# Altium schematic sheet top.SchDoc
size C; SheetNumber: 1
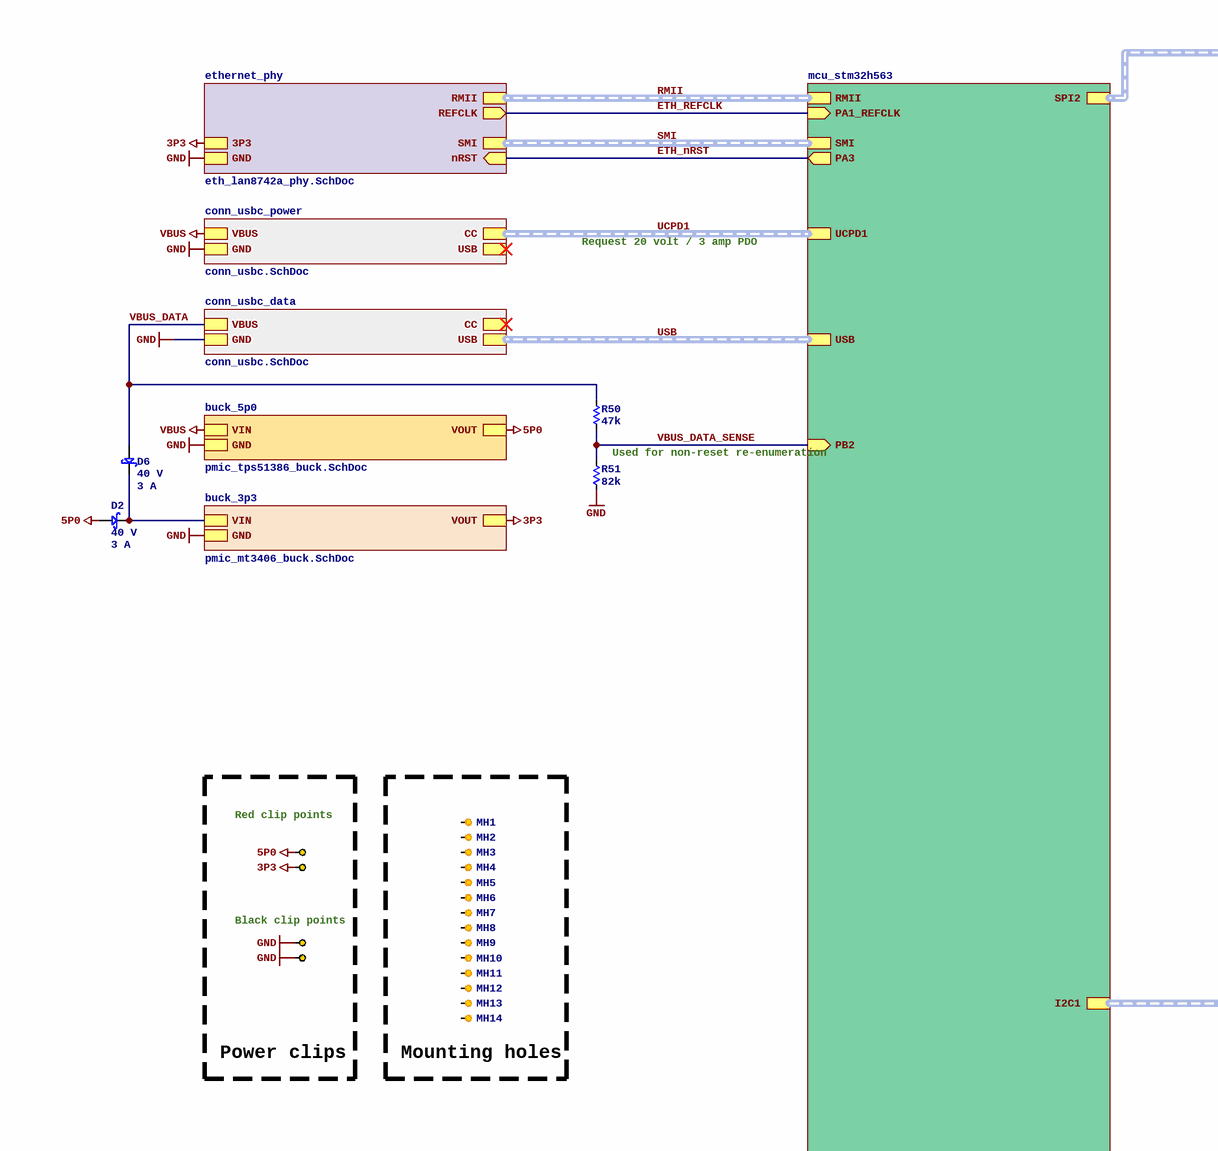
[diagram p0: top.SchDoc, top left]
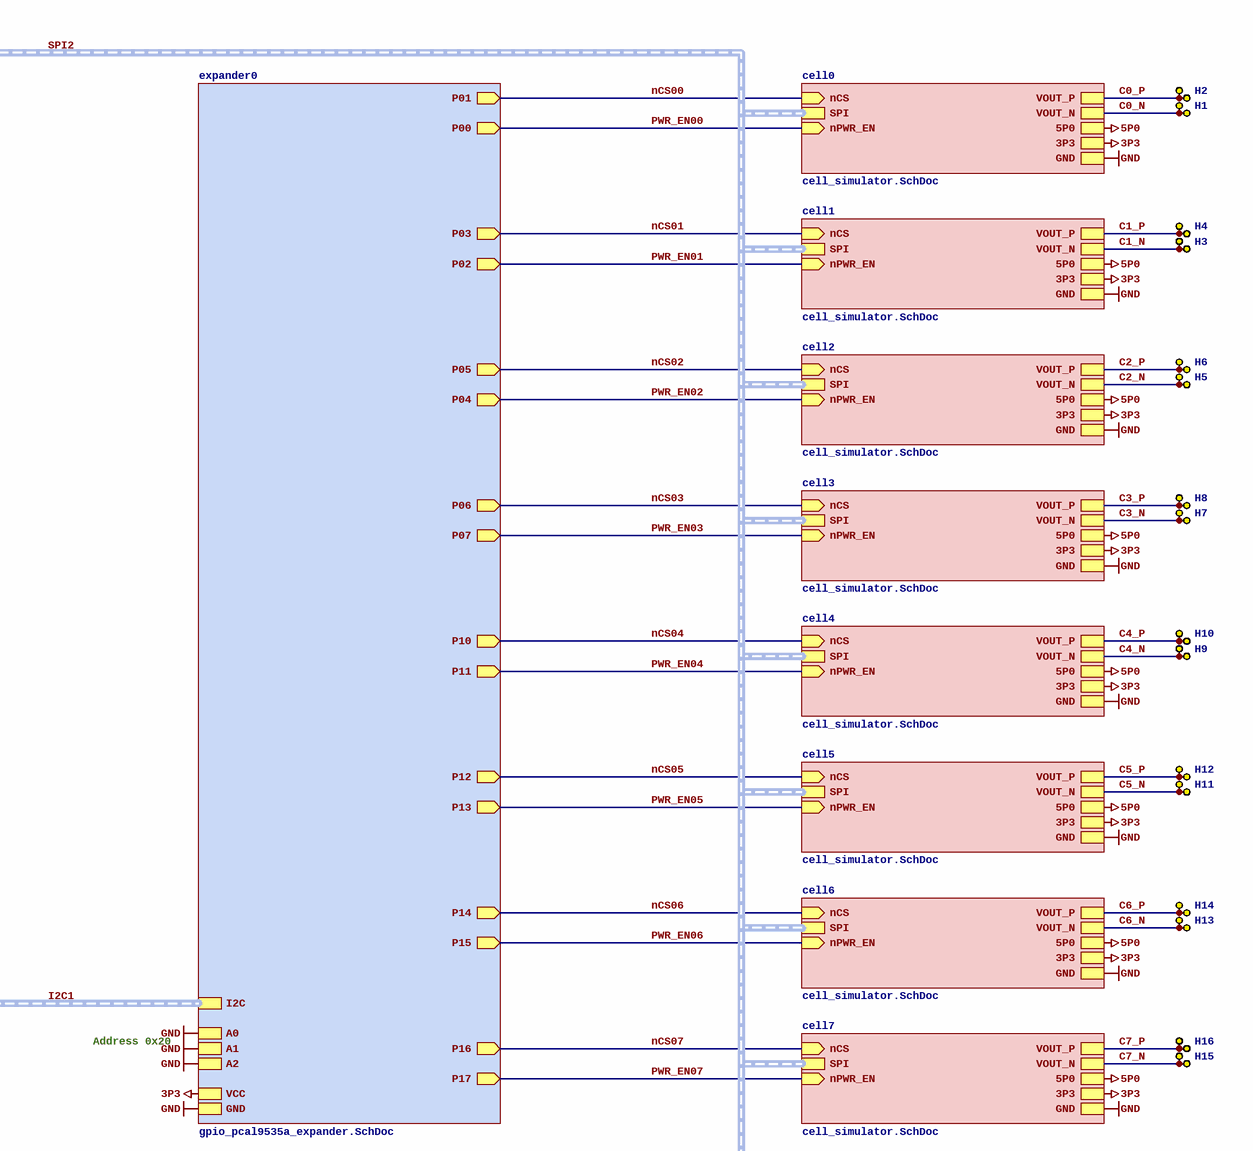
[diagram p1: top.SchDoc, top right]
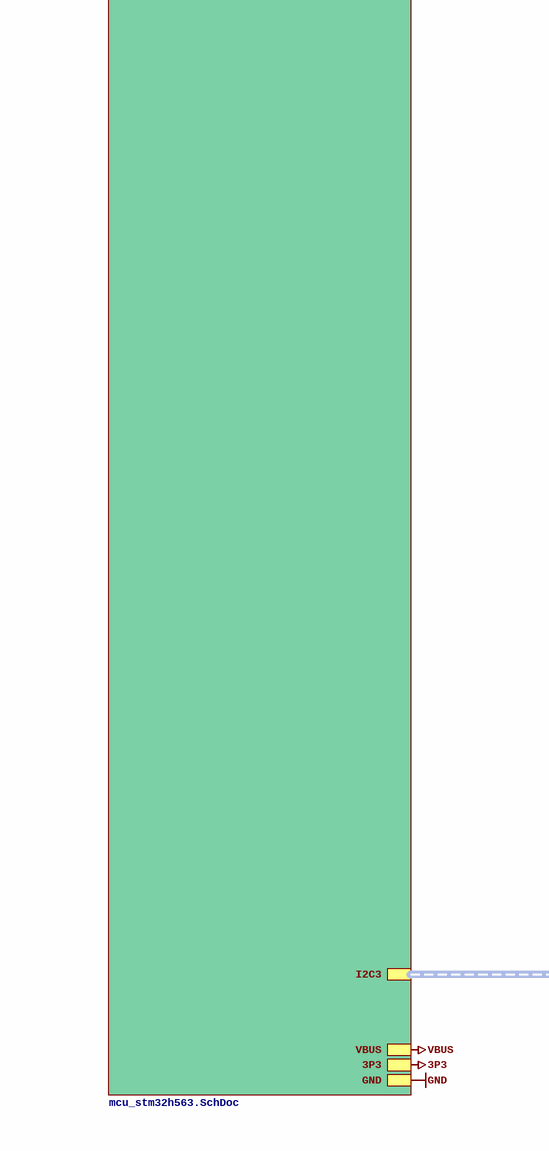
[diagram p2: top.SchDoc, bottom left]
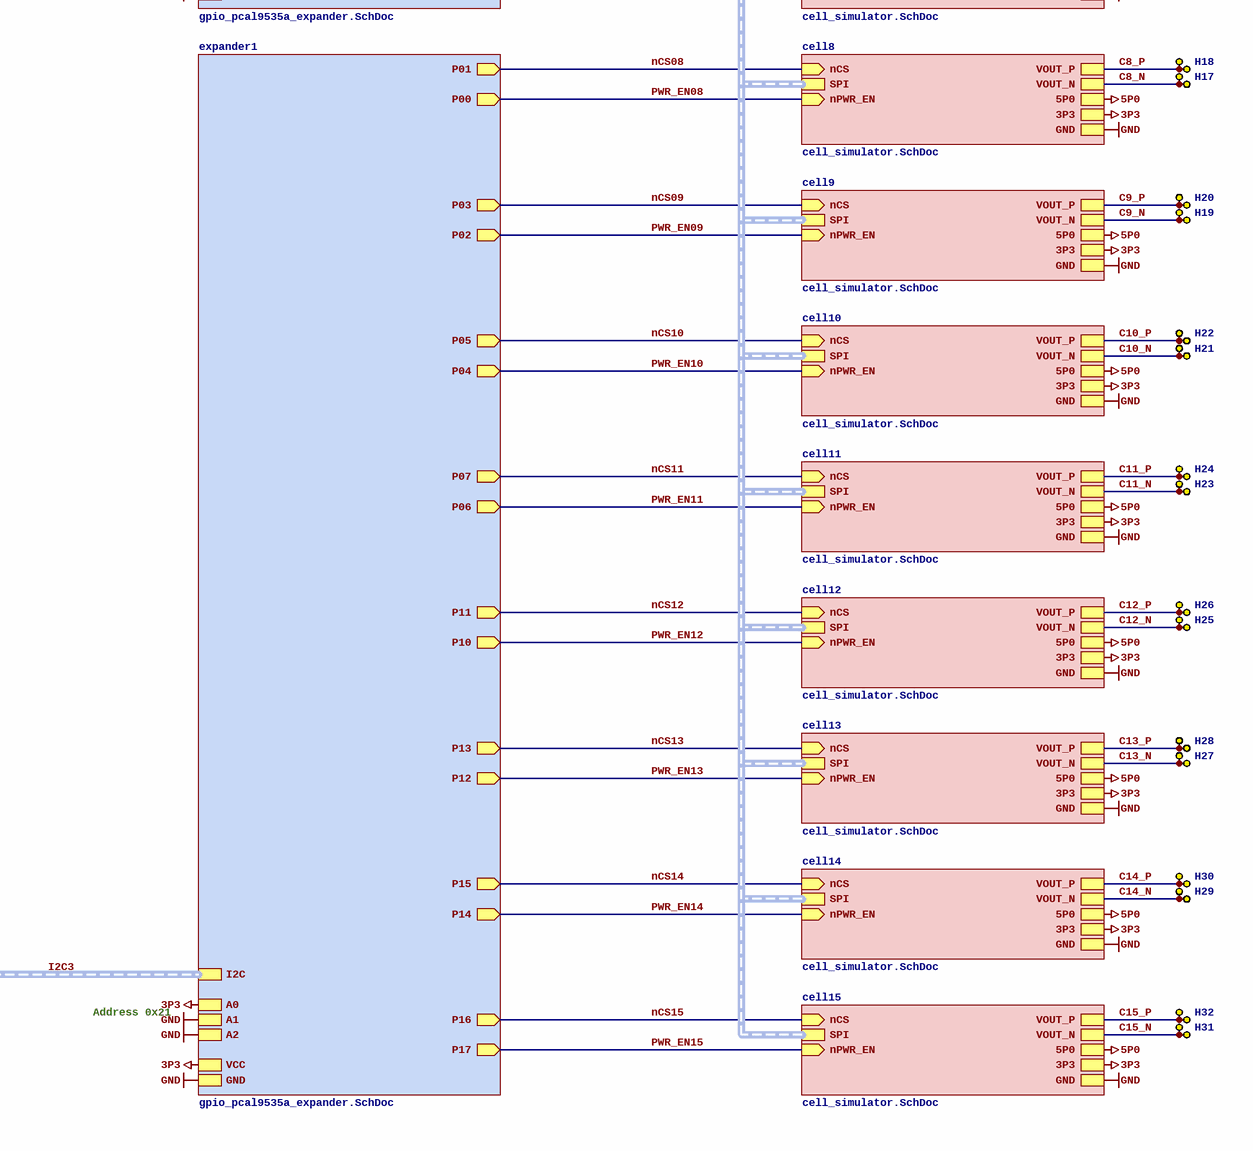
[diagram p3: top.SchDoc, bottom right]

## Parts
D2  Vr: 40 V  Current: 3 A  [SMA]  (hidden comment: B340A-13-F)
D6  Vr: 40 V  Current: 3 A  [SMA]  (hidden comment: B340A-13-F)
H1  SMTSO20100CTJ  [SINHOO_SMTSO20100CTJ]  (value not drawn)
H2  SMTSO20100CTJ  [SINHOO_SMTSO20100CTJ]  (value not drawn)
H3  SMTSO20100CTJ  [SINHOO_SMTSO20100CTJ]  (value not drawn)
H4  SMTSO20100CTJ  [SINHOO_SMTSO20100CTJ]  (value not drawn)
H5  SMTSO20100CTJ  [SINHOO_SMTSO20100CTJ]  (value not drawn)
H6  SMTSO20100CTJ  [SINHOO_SMTSO20100CTJ]  (value not drawn)
H7  SMTSO20100CTJ  [SINHOO_SMTSO20100CTJ]  (value not drawn)
H8  SMTSO20100CTJ  [SINHOO_SMTSO20100CTJ]  (value not drawn)
H9  SMTSO20100CTJ  [SINHOO_SMTSO20100CTJ]  (value not drawn)
H10  SMTSO20100CTJ  [SINHOO_SMTSO20100CTJ]  (value not drawn)
H11  SMTSO20100CTJ  [SINHOO_SMTSO20100CTJ]  (value not drawn)
H12  SMTSO20100CTJ  [SINHOO_SMTSO20100CTJ]  (value not drawn)
H13  SMTSO20100CTJ  [SINHOO_SMTSO20100CTJ]  (value not drawn)
H14  SMTSO20100CTJ  [SINHOO_SMTSO20100CTJ]  (value not drawn)
H15  SMTSO20100CTJ  [SINHOO_SMTSO20100CTJ]  (value not drawn)
H16  SMTSO20100CTJ  [SINHOO_SMTSO20100CTJ]  (value not drawn)
H17  SMTSO20100CTJ  [SINHOO_SMTSO20100CTJ]  (value not drawn)
H18  SMTSO20100CTJ  [SINHOO_SMTSO20100CTJ]  (value not drawn)
H19  SMTSO20100CTJ  [SINHOO_SMTSO20100CTJ]  (value not drawn)
H20  SMTSO20100CTJ  [SINHOO_SMTSO20100CTJ]  (value not drawn)
H21  SMTSO20100CTJ  [SINHOO_SMTSO20100CTJ]  (value not drawn)
H22  SMTSO20100CTJ  [SINHOO_SMTSO20100CTJ]  (value not drawn)
H23  SMTSO20100CTJ  [SINHOO_SMTSO20100CTJ]  (value not drawn)
H24  SMTSO20100CTJ  [SINHOO_SMTSO20100CTJ]  (value not drawn)
H25  SMTSO20100CTJ  [SINHOO_SMTSO20100CTJ]  (value not drawn)
H26  SMTSO20100CTJ  [SINHOO_SMTSO20100CTJ]  (value not drawn)
H27  SMTSO20100CTJ  [SINHOO_SMTSO20100CTJ]  (value not drawn)
H28  SMTSO20100CTJ  [SINHOO_SMTSO20100CTJ]  (value not drawn)
H29  SMTSO20100CTJ  [SINHOO_SMTSO20100CTJ]  (value not drawn)
H30  SMTSO20100CTJ  [SINHOO_SMTSO20100CTJ]  (value not drawn)
H31  SMTSO20100CTJ  [SINHOO_SMTSO20100CTJ]  (value not drawn)
H32  SMTSO20100CTJ  [SINHOO_SMTSO20100CTJ]  (value not drawn)
MH1  HOLE_M3  [HOLE_M3]  (value not drawn)  (no BOM)
MH2  HOLE_M3  [HOLE_M3]  (value not drawn)  (no BOM)
MH3  HOLE_M3  [HOLE_M3]  (value not drawn)  (no BOM)
MH4  HOLE_M3  [HOLE_M3]  (value not drawn)  (no BOM)
MH5  HOLE_M3  [HOLE_M3]  (value not drawn)  (no BOM)
MH6  HOLE_M3  [HOLE_M3]  (value not drawn)  (no BOM)
MH7  HOLE_M3  [HOLE_M3]  (value not drawn)  (no BOM)
MH8  HOLE_M3  [HOLE_M3]  (value not drawn)  (no BOM)
MH9  HOLE_M3  [HOLE_M3]  (value not drawn)  (no BOM)
MH10  HOLE_M3  [HOLE_M3]  (value not drawn)  (no BOM)
MH11  HOLE_M3  [HOLE_M3]  (value not drawn)  (no BOM)
MH12  HOLE_M3  [HOLE_M3]  (value not drawn)  (no BOM)
MH13  HOLE_M3  [HOLE_M3]  (value not drawn)  (no BOM)
MH14  HOLE_M3  [HOLE_M3]  (value not drawn)  (no BOM)
R50  value 47k  [R0402]  (hidden comment: 0402WGF4702TCE)
R51  value 82k  [R0402]  (hidden comment: FRC0402F8202TS)
TP4  RH-5000  [TP_RH-5000]  (value not drawn)
TP5  RH-5001  [TP_RH-5001]  (value not drawn)
TP6  RH-5000  [TP_RH-5000]  (value not drawn)
TP7  RH-5001  [TP_RH-5001]  (value not drawn)
TP8  RH-5000  [TP_RH-5000]  (value not drawn)
TP9  RH-5001  [TP_RH-5001]  (value not drawn)
TP10  RH-5000  [TP_RH-5000]  (value not drawn)
TP11  RH-5001  [TP_RH-5001]  (value not drawn)
TP12  RH-5000  [TP_RH-5000]  (value not drawn)
TP13  RH-5001  [TP_RH-5001]  (value not drawn)
TP14  RH-5000  [TP_RH-5000]  (value not drawn)
TP15  RH-5001  [TP_RH-5001]  (value not drawn)
TP16  RH-5000  [TP_RH-5000]  (value not drawn)
TP17  RH-5001  [TP_RH-5001]  (value not drawn)
TP18  RH-5000  [TP_RH-5000]  (value not drawn)
TP19  RH-5001  [TP_RH-5001]  (value not drawn)
TP20  RH-5000  [TP_RH-5000]  (value not drawn)
TP21  RH-5001  [TP_RH-5001]  (value not drawn)
TP22  RH-5000  [TP_RH-5000]  (value not drawn)
TP23  RH-5001  [TP_RH-5001]  (value not drawn)
TP24  RH-5000  [TP_RH-5000]  (value not drawn)
TP25  RH-5001  [TP_RH-5001]  (value not drawn)
TP26  RH-5000  [TP_RH-5000]  (value not drawn)
TP27  RH-5001  [TP_RH-5001]  (value not drawn)
TP28  RH-5000  [TP_RH-5000]  (value not drawn)
TP29  RH-5001  [TP_RH-5001]  (value not drawn)
TP30  RH-5000  [TP_RH-5000]  (value not drawn)
TP31  RH-5001  [TP_RH-5001]  (value not drawn)
TP32  RH-5000  [TP_RH-5000]  (value not drawn)
TP33  RH-5000  [TP_RH-5000]  (value not drawn)
TP34  RH-5001  [TP_RH-5001]  (value not drawn)
TP35  RH-5000  [TP_RH-5000]  (value not drawn)
TP36  RH-5000  [TP_RH-5000]  (value not drawn)
TP38  RH-5001  [TP_RH-5001]  (value not drawn)
TP39  RH-5001  [TP_RH-5001]  (value not drawn)
TP43  RH-5001  [TP_RH-5001]  (value not drawn)

## Blocks framed on the sheet
Power clips: TP33 TP35 TP39 TP43
Mounting holes: MH1-MH14

## Sub-sheets
buck_3p3 = pmic_mt3406_buck.SchDoc: GND, VIN, VOUT
buck_5p0 = pmic_tps51386_buck.SchDoc: GND, VOUT, VIN
cell0 = cell_simulator.SchDoc: VOUT_P, GND, 5P0, VOUT_N, SPI (harness SPI), nCS (in), nPWR_EN (in), 3P3
cell1 = cell_simulator.SchDoc: VOUT_P, VOUT_N, SPI (harness SPI), nCS (in), nPWR_EN (in), GND, 5P0, 3P3
cell2 = cell_simulator.SchDoc: VOUT_P, VOUT_N, SPI (harness SPI), nCS (in), nPWR_EN (in), GND, 5P0, 3P3
cell3 = cell_simulator.SchDoc: VOUT_P, VOUT_N, SPI (harness SPI), nCS (in), nPWR_EN (in), GND, 5P0, 3P3
cell4 = cell_simulator.SchDoc: VOUT_P, VOUT_N, SPI (harness SPI), nCS (in), nPWR_EN (in), GND, 5P0, 3P3
cell5 = cell_simulator.SchDoc: VOUT_P, VOUT_N, SPI (harness SPI), nCS (in), nPWR_EN (in), GND, 5P0, 3P3
cell6 = cell_simulator.SchDoc: VOUT_P, VOUT_N, SPI (harness SPI), nCS (in), nPWR_EN (in), GND, 5P0, 3P3
cell7 = cell_simulator.SchDoc: VOUT_P, VOUT_N, SPI (harness SPI), nCS (in), nPWR_EN (in), GND, 5P0, 3P3
cell8 = cell_simulator.SchDoc: VOUT_P, VOUT_N, SPI (harness SPI), nCS (in), nPWR_EN (in), GND, 5P0, 3P3
cell9 = cell_simulator.SchDoc: VOUT_P, VOUT_N, SPI (harness SPI), nCS (in), nPWR_EN (in), GND, 5P0, 3P3
cell10 = cell_simulator.SchDoc: VOUT_P, VOUT_N, SPI (harness SPI), nCS (in), nPWR_EN (in), GND, 5P0, 3P3
cell11 = cell_simulator.SchDoc: VOUT_P, VOUT_N, SPI (harness SPI), nCS (in), nPWR_EN (in), GND, 5P0, 3P3
cell12 = cell_simulator.SchDoc: VOUT_P, VOUT_N, SPI (harness SPI), nCS (in), nPWR_EN (in), GND, 5P0, 3P3
cell13 = cell_simulator.SchDoc: VOUT_P, VOUT_N, SPI (harness SPI), nCS (in), nPWR_EN (in), GND, 5P0, 3P3
cell14 = cell_simulator.SchDoc: VOUT_P, VOUT_N, SPI (harness SPI), nCS (in), nPWR_EN (in), GND, 5P0, 3P3
cell15 = cell_simulator.SchDoc: VOUT_P, VOUT_N, SPI (harness SPI), nCS (in), nPWR_EN (in), GND, 5P0, 3P3
conn_usbc_data = conn_usbc.SchDoc: USB (harness DIFF), GND, VBUS, CC (harness CC)
conn_usbc_power = conn_usbc.SchDoc: USB (harness DIFF), GND, VBUS, CC (harness CC)
ethernet_phy = eth_lan8742a_phy.SchDoc: 3P3, GND, REFCLK (out), RMII (harness RMII), nRST (in), SMI (harness SMI)
expander0 = gpio_pcal9535a_expander.SchDoc: A0, A1, GND, VCC, P06 (out), P07 (out), P10 (out), P11 (out), P12 (out), P13 (out), P14 (out), P15 (out), P16 (out), P17 (out), I2C (harness I2C), A2, P01 (out), P00 (out), P05 (out), P04 (out), P03 (out), P02 (out)
expander1 = gpio_pcal9535a_expander.SchDoc: A0, A1, GND, VCC, I2C (harness I2C), A2, P11 (out), P10 (out), P13 (out), P12 (out), P15 (out), P14 (out), P16 (out), P17 (out), P07 (out), P06 (out), P05 (out), P04 (out), P03 (out), P02 (out), P01 (out), P00 (out)
mcu_stm32h563 = mcu_stm32h563.SchDoc: GND, 3P3, PA1_REFCLK (in), RMII (harness RMII), SMI (harness SMI), VBUS, USB (harness DIFF), PA3 (out), UCPD1 (harness CC), SPI2 (harness SPI), I2C1 (harness I2C), I2C3 (harness I2C), PB2 (in)

## Nets
3P3: TP35.1 ; sheet mcu_stm32h563/3P3, sheet ethernet_phy/3P3, sheet buck_3p3/VOUT, sheet cell0/3P3, sheet cell1/3P3, sheet cell2/3P3, sheet cell3/3P3, sheet cell4/3P3, sheet cell5/3P3, sheet cell6/3P3, sheet cell7/3P3, sheet cell8/3P3, sheet cell9/3P3, sheet cell10/3P3, sheet cell11/3P3, sheet cell12/3P3, sheet cell13/3P3, sheet cell14/3P3, sheet cell15/3P3, sheet expander0/VCC, sheet expander1/A0, sheet expander1/VCC
5P0: D2.1 TP33.1 ; sheet cell0/5P0, sheet cell1/5P0, sheet cell2/5P0, sheet cell3/5P0, sheet cell4/5P0, sheet cell5/5P0, sheet cell6/5P0, sheet cell7/5P0, sheet cell8/5P0, sheet cell9/5P0, sheet cell10/5P0, sheet cell11/5P0, sheet cell12/5P0, sheet cell13/5P0, sheet cell14/5P0, sheet cell15/5P0, sheet buck_5p0/VOUT
GND: R51.1 TP39.1 TP43.1 ; sheet mcu_stm32h563/GND, sheet conn_usbc_power/GND, sheet ethernet_phy/GND, sheet conn_usbc_data/GND, sheet buck_3p3/GND, sheet cell0/GND, sheet cell1/GND, sheet cell2/GND, sheet cell3/GND, sheet cell4/GND, sheet cell5/GND, sheet cell6/GND, sheet cell7/GND, sheet cell8/GND, sheet cell9/GND, sheet cell10/GND, sheet cell11/GND, sheet cell12/GND, sheet cell13/GND, sheet cell14/GND, sheet cell15/GND, sheet buck_5p0/GND, sheet expander0/A0, sheet expander0/A1, sheet expander0/GND, sheet expander0/A2, sheet expander1/A1, sheet expander1/GND, sheet expander1/A2
VBUS: sheet mcu_stm32h563/VBUS, sheet conn_usbc_power/VBUS, sheet buck_5p0/VIN
C0_N: H1.1 TP5.1 ; sheet cell0/VOUT_N
C0_P: H2.1 TP4.1 ; sheet cell0/VOUT_P
C1_N: H3.1 TP7.1 ; sheet cell1/VOUT_N
C1_P: H4.1 TP6.1 ; sheet cell1/VOUT_P
C2_N: H5.1 TP9.1 ; sheet cell2/VOUT_N
C2_P: H6.1 TP8.1 ; sheet cell2/VOUT_P
C3_N: H7.1 TP11.1 ; sheet cell3/VOUT_N
C3_P: H8.1 TP10.1 ; sheet cell3/VOUT_P
C4_N: H9.1 TP13.1 ; sheet cell4/VOUT_N
C4_P: H10.1 TP12.1 ; sheet cell4/VOUT_P
C5_N: H11.1 TP15.1 ; sheet cell5/VOUT_N
C5_P: H12.1 TP14.1 ; sheet cell5/VOUT_P
C6_N: H13.1 TP17.1 ; sheet cell6/VOUT_N
C6_P: H14.1 TP16.1 ; sheet cell6/VOUT_P
C7_N: H15.1 TP19.1 ; sheet cell7/VOUT_N
C7_P: H16.1 TP18.1 ; sheet cell7/VOUT_P
C8_N: H17.1 TP21.1 ; sheet cell8/VOUT_N
C8_P: H18.1 TP20.1 ; sheet cell8/VOUT_P
C9_N: H19.1 TP23.1 ; sheet cell9/VOUT_N
C9_P: H20.1 TP22.1 ; sheet cell9/VOUT_P
C10_N: H21.1 TP25.1 ; sheet cell10/VOUT_N
C10_P: H22.1 TP24.1 ; sheet cell10/VOUT_P
C11_N: H23.1 TP27.1 ; sheet cell11/VOUT_N
C11_P: H24.1 TP26.1 ; sheet cell11/VOUT_P
C12_N: H25.1 TP29.1 ; sheet cell12/VOUT_N
C12_P: H26.1 TP28.1 ; sheet cell12/VOUT_P
C13_N: H27.1 TP31.1 ; sheet cell13/VOUT_N
C13_P: H28.1 TP30.1 ; sheet cell13/VOUT_P
C14_N: H29.1 TP34.1 ; sheet cell14/VOUT_N
C14_P: H30.1 TP32.1 ; sheet cell14/VOUT_P
C15_N: H31.1 TP38.1 ; sheet cell15/VOUT_N
C15_P: H32.1 TP36.1 ; sheet cell15/VOUT_P
ETH_nRST: sheet mcu_stm32h563/PA3, sheet ethernet_phy/nRST
ETH_REFCLK: sheet mcu_stm32h563/PA1_REFCLK, sheet ethernet_phy/REFCLK
nCS00: sheet cell0/nCS, sheet expander0/P01
nCS01: sheet cell1/nCS, sheet expander0/P03
nCS02: sheet cell2/nCS, sheet expander0/P05
nCS03: sheet cell3/nCS, sheet expander0/P06
nCS04: sheet cell4/nCS, sheet expander0/P10
nCS05: sheet cell5/nCS, sheet expander0/P12
nCS06: sheet cell6/nCS, sheet expander0/P14
nCS07: sheet cell7/nCS, sheet expander0/P16
nCS08: sheet cell8/nCS, sheet expander1/P01
nCS09: sheet cell9/nCS, sheet expander1/P03
nCS10: sheet cell10/nCS, sheet expander1/P05
nCS11: sheet cell11/nCS, sheet expander1/P07
nCS12: sheet cell12/nCS, sheet expander1/P11
nCS13: sheet cell13/nCS, sheet expander1/P13
nCS14: sheet cell14/nCS, sheet expander1/P15
nCS15: sheet cell15/nCS, sheet expander1/P16
PWR_EN00: sheet cell0/nPWR_EN, sheet expander0/P00
PWR_EN01: sheet cell1/nPWR_EN, sheet expander0/P02
PWR_EN02: sheet cell2/nPWR_EN, sheet expander0/P04
PWR_EN03: sheet cell3/nPWR_EN, sheet expander0/P07
PWR_EN04: sheet cell4/nPWR_EN, sheet expander0/P11
PWR_EN05: sheet cell5/nPWR_EN, sheet expander0/P13
PWR_EN06: sheet cell6/nPWR_EN, sheet expander0/P15
PWR_EN07: sheet cell7/nPWR_EN, sheet expander0/P17
PWR_EN08: sheet cell8/nPWR_EN, sheet expander1/P00
PWR_EN09: sheet cell9/nPWR_EN, sheet expander1/P02
PWR_EN10: sheet cell10/nPWR_EN, sheet expander1/P04
PWR_EN11: sheet cell11/nPWR_EN, sheet expander1/P06
PWR_EN12: sheet cell12/nPWR_EN, sheet expander1/P10
PWR_EN13: sheet cell13/nPWR_EN, sheet expander1/P12
PWR_EN14: sheet cell14/nPWR_EN, sheet expander1/P14
PWR_EN15: sheet cell15/nPWR_EN, sheet expander1/P17
VBUS_DATA: D6.1 R50.2 ; sheet conn_usbc_data/VBUS
VBUS_DATA_SENSE: R50.1 R51.2 ; sheet mcu_stm32h563/PB2
NetD2_2: D2.2 D6.2 ; sheet buck_3p3/VIN

Not connected (* = marked no-connect by the designer): MH1 1; MH2 1; MH3 1; MH4 1; MH5 1; MH6 1; MH7 1; MH8 1; MH9 1; MH10 1; MH11 1; MH12 1; MH13 1; MH14 1

## Buses and harness runs
harness I2C1 = sheet expander0/I2C = sheet mcu_stm32h563/I2C1
harness I2C3 = sheet expander1/I2C = sheet mcu_stm32h563/I2C3
harness RMII = sheet ethernet_phy/RMII = sheet mcu_stm32h563/RMII
harness SMI = sheet ethernet_phy/SMI = sheet mcu_stm32h563/SMI
harness SPI2 = sheet cell0/SPI = sheet cell1/SPI = sheet cell2/SPI = sheet cell3/SPI = sheet cell4/SPI = sheet cell5/SPI = sheet cell6/SPI = sheet cell7/SPI = sheet cell8/SPI = sheet cell9/SPI = sheet cell10/SPI = sheet cell11/SPI = sheet cell12/SPI = sheet cell13/SPI = sheet cell14/SPI = sheet cell15/SPI = sheet mcu_stm32h563/SPI2
harness UCPD1 = sheet conn_usbc_power/CC = sheet mcu_stm32h563/UCPD1
harness USB = sheet conn_usbc_data/USB = sheet mcu_stm32h563/USB

## Notes on the sheet
- Request 20 volt / 3 amp PDO
- Used for non-reset re-enumeration
- Red clip points
- (near TP39) Black clip points
- Address 0x20
- Address 0x21

## Library data of the parts
D2 D6 = B340A-13-F: Rectifier Diode, Schottky, 1 Phase, 1 Element, 3A, 40V V(RRM), Silicon; Manufacturer: Diodes; Supplier 1: DigiKey; ComponentLink1URL: https://www.diodes.com/assets/Datasheets/ds30891.pdf; Supplier Part Number 1: B340A-FDICT-ND; Manufacturer Part Number: B340A-13-F; ComponentLink1Description: Datasheet; Supplier 2: LCSC; Supplier Part Number 2: C85098; Diode Type: Schottky; Supplier 3: Mouser; Supplier Part Number 3: 621-B340A-F
H1-H32 = SMTSO20100CTJ: Standoff M2 x 0.4, tin-plated, 10 mm height; Manufacturer: Sinhoo; Manufacturer Part Number: SMTSO20100CTJ; ComponentLink1Description: Catalog; ComponentLink1URL: https://www.lcsc.com/datasheet/C2928171.pdf; Supplier 2: LCSC; Supplier Part Number 2: C2928171
R50 = 0402WGF4702TCE: Manufacturer: UNI-ROYAL(Uniroyal Elec); Power Rating (mW): 62.5; Tolerance: 1%; Temperature Coefficient: ±100ppm/?; Manufacturer Part Number: 0402WGF4702TCE; Package: 0402; Supplier 2: LCSC; Supplier Part Number 2: C25792; ComponentLink1Description: Datasheet; ComponentLink1URL: https://wmsc.lcsc.com/wmsc/upload/file/pdf/v2/lcsc/2206010100_UNI-ROYAL-Uniroyal-Elec-0402WGF4702TCE_C25792.pdf
R51 = FRC0402F8202TS: Manufacturer: FOJAN; Power Rating (mW): 62.5; Tolerance: 1%; Temperature Coefficient: ±100ppm/?; Manufacturer Part Number: FRC0402F8202TS; Package: 0402; Supplier 2: LCSC; Supplier Part Number 2: C2909388; ComponentLink1Description: Datasheet; ComponentLink1URL: https://datasheet.lcsc.com/lcsc/2308241009_FOJAN-FRC0402F8202TS_C2909388.pdf
TP4 TP6 TP8 TP10 TP12 TP14 TP16 TP18 TP20 TP22 TP24 TP26 TP28 TP30 TP32 TP33 TP35 TP36 = RH-5000: Red through-hole PCB test point; Manufacturer: ronghe; ComponentLink1Description: Datasheet; ComponentLink1URL: https://datasheet.lcsc.com/lcsc/2307040929_ronghe-RH-5000_C5277086.pdf; Manufacturer Part Number: RH-5000; Supplier 2: LCSC; Supplier Part Number 2: C5277086
TP5 TP7 TP9 TP11 TP13 TP15 TP17 TP19 TP21 TP23 TP25 TP27 TP29 TP31 TP34 TP38 TP39 TP43 = RH-5001: Black through-hole PCB test point; Manufacturer: ronghe; ComponentLink1Description: Datasheet; ComponentLink1URL: https://datasheet.lcsc.com/lcsc/2307040929_ronghe-RH-5000_C5277086.pdf; Manufacturer Part Number: RH-5001; Supplier 2: LCSC; Supplier Part Number 2: C5199801
MH1-MH14 = HOLE_M3: Manufacturer Part Number: HOLE_M3